# EasyEDA Pro project ProDoc_Board1.epro

# Schematic Schematic1

## Sheets
1 P1: Board Name: Board1; Create Date: 2025-09-09; Page Name: P1; Project Name: usbc-fursuit-fan; Schematic Name: Schematic1; Update Date: 2025-09-09; Company: EasyEDA.com; Page Size: A4; Version: V1.0
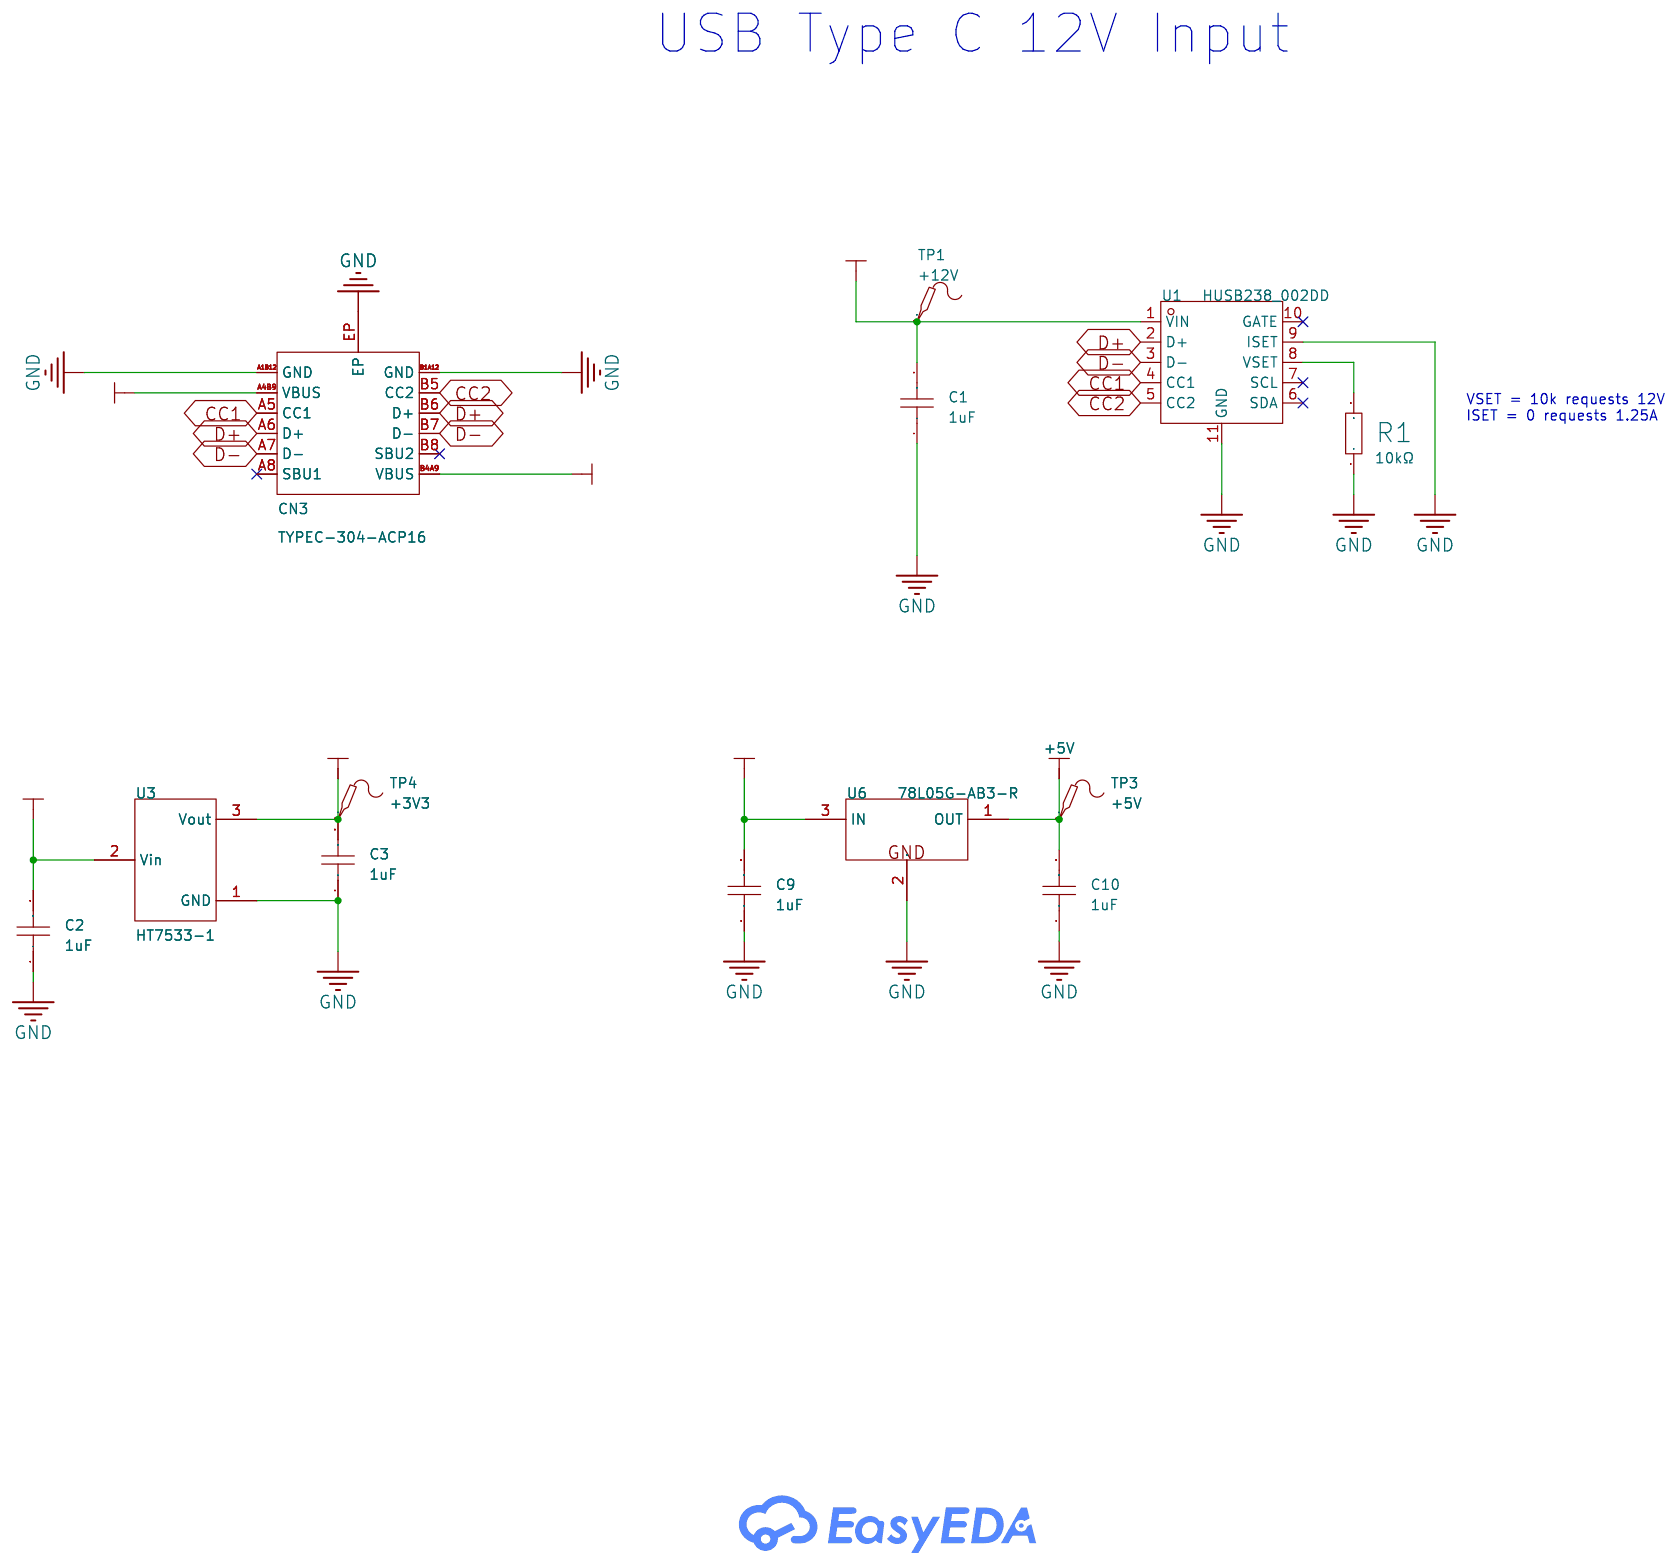
[diagram p0: P1]
2 P2: Page Name: P2; Update Date: 2025-09-11
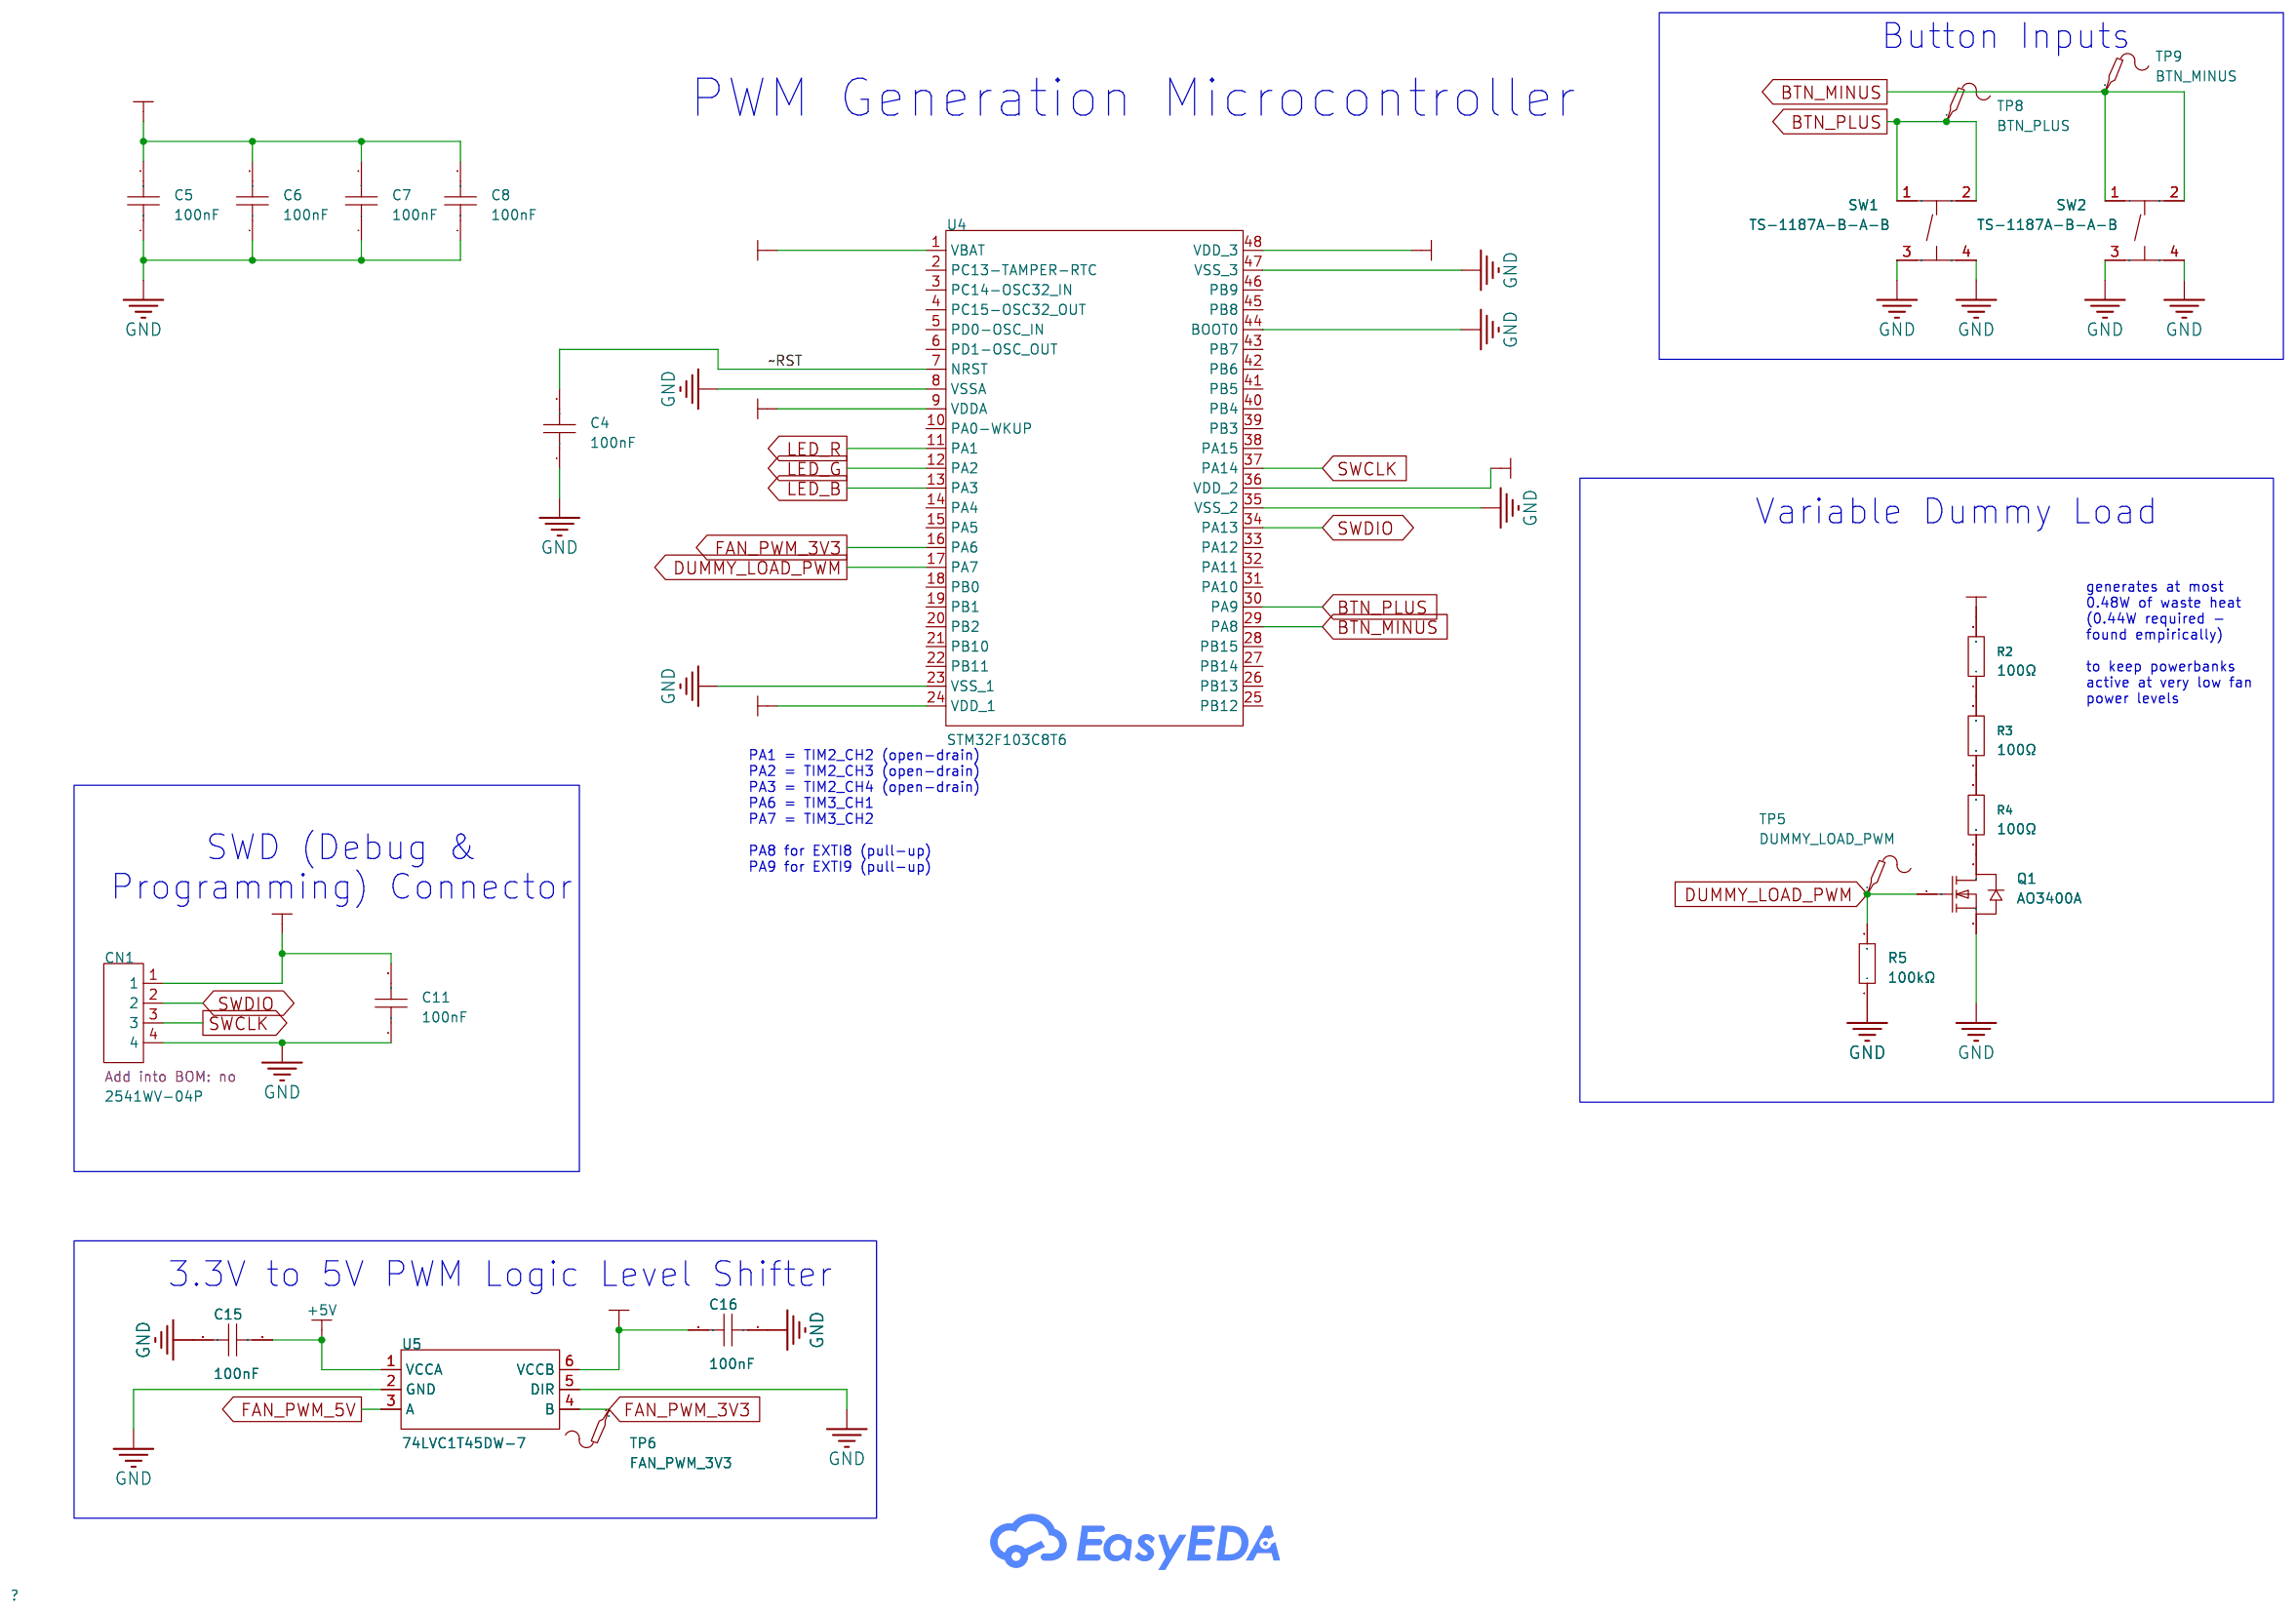
[diagram p1: P2]
3 P3: Page Name: P3; Update Date: 2025-09-11
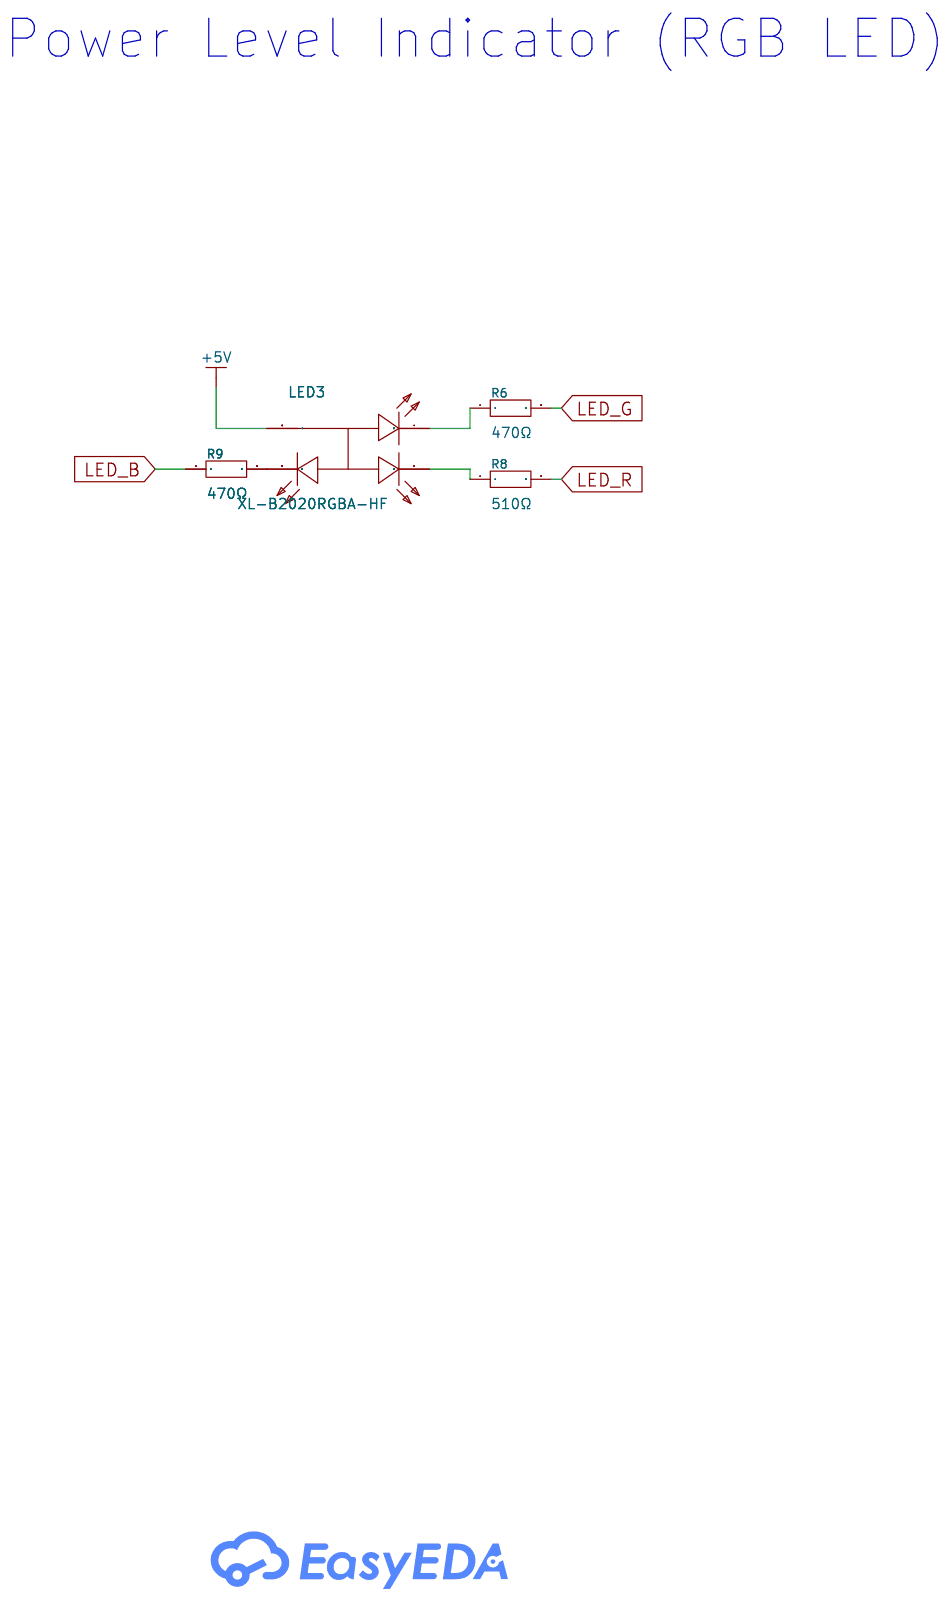
[diagram p2: P3]
4 P4: Create Date: 2025-09-10; Page Name: P4; Update Date: 2025-09-11
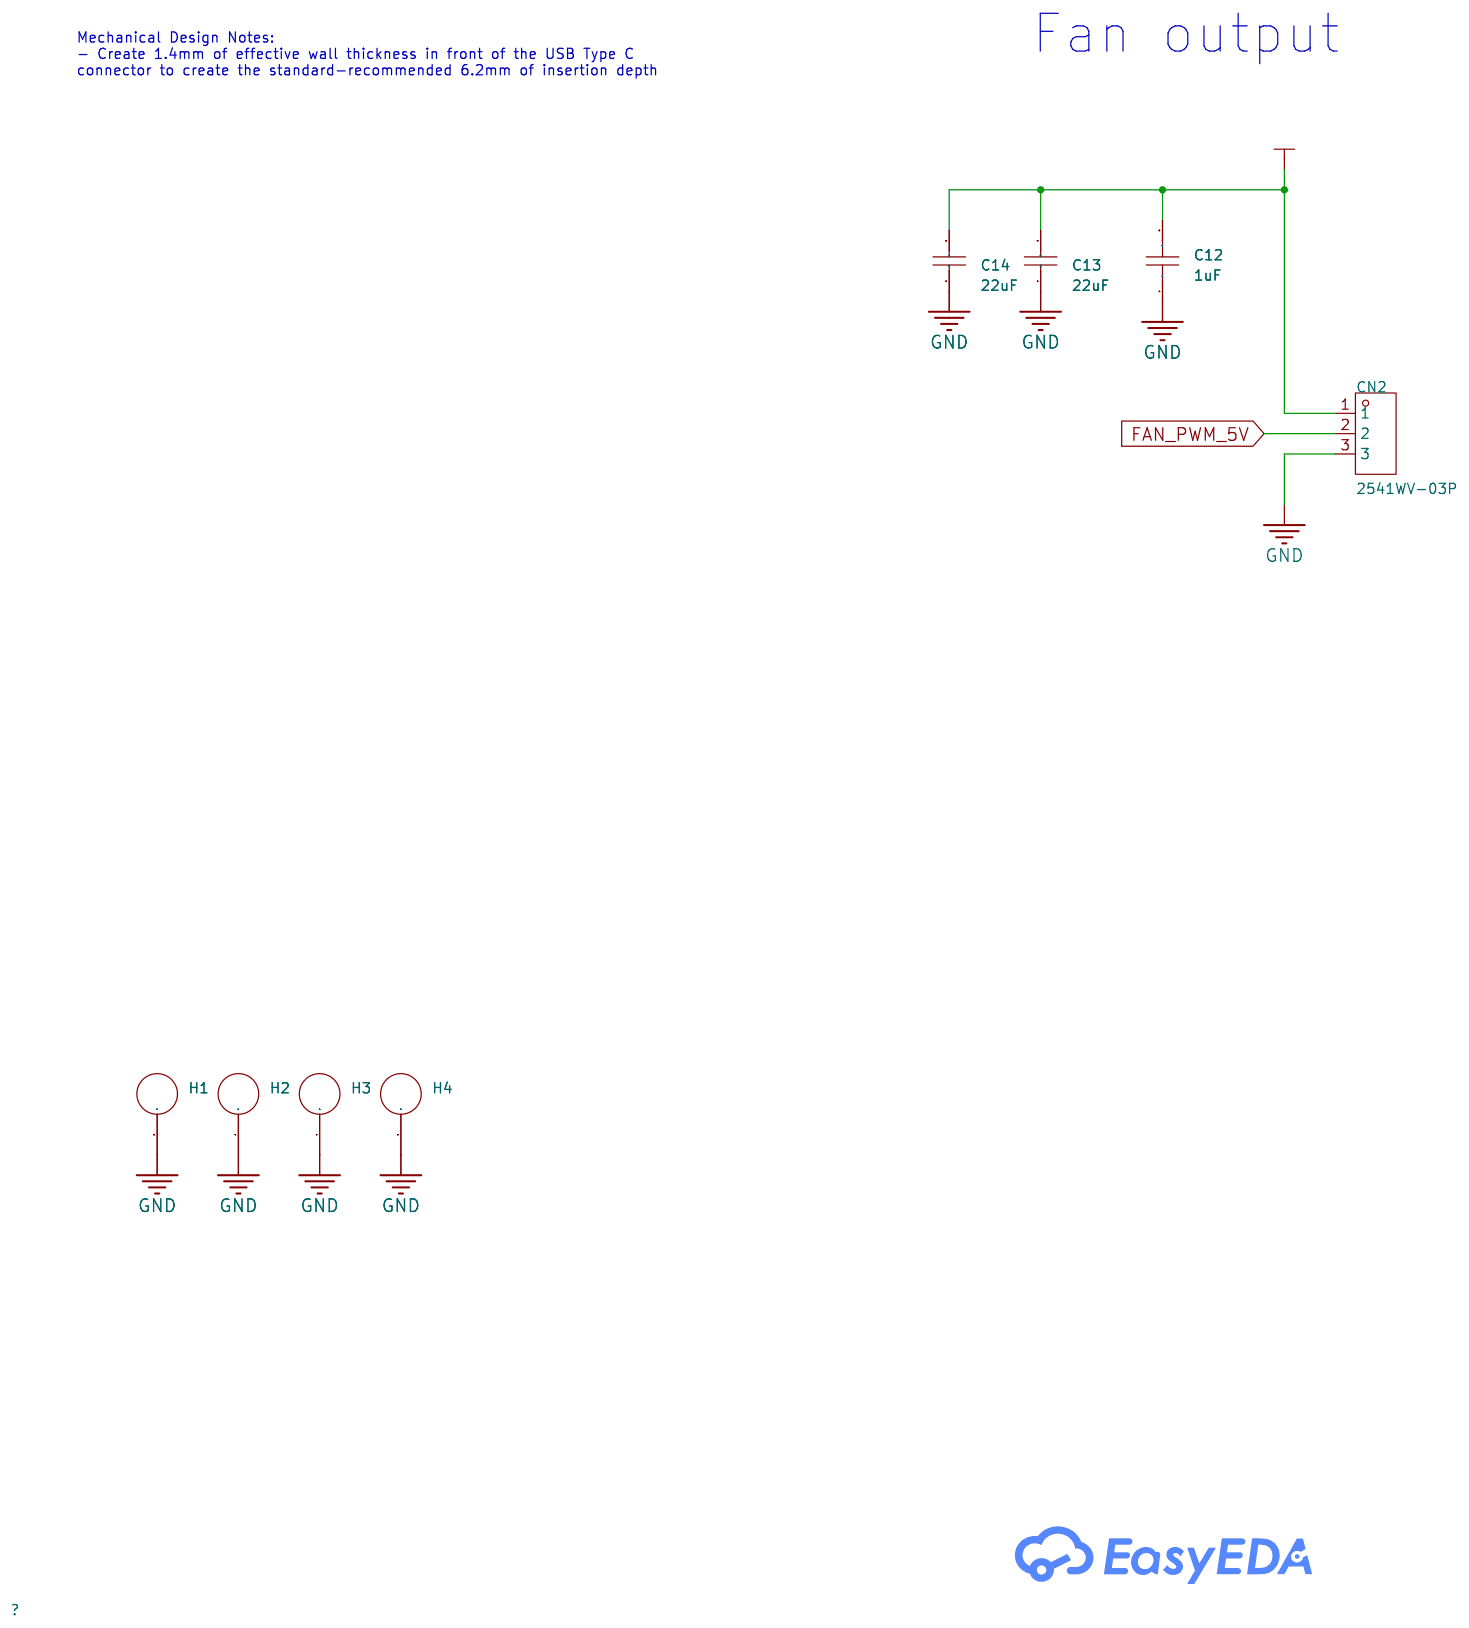
[diagram p3: P4]

## Parts
sheet P1
C1  1uF  [C0603]
C2  1uF  [C0603]
C3  1uF  [C0603]
C9  1uF  [C0603]
C10  1uF  [C0603]
CN3  TYPEC-304-ACP16  [USB-C-SMD_TYPE-C-16P-1]
R1  10kΩ  [R0603]
TP1  +12V  [Test-Point-0.5mm]
TP3  +5V  [Test-Point-0.5mm]
TP4  +3V3  [Test-Point-0.5mm]
U1  HUSB238_002DD  [DFN-10_L3.0-W3.0-P0.50-BL-EP2.5]
U3  HT7533-1  [SOT-89-3_L4.5-W2.5-P1.50-LS4.2-BR]
U6  78L05G-AB3-R  [SOT-89-3_L4.5-W2.5-P1.50-LS4.2-BR]
sheet P2
C4  100nF  [C0603]
C5  100nF  [C0603]
C6  100nF  [C0603]
C7  100nF  [C0603]
C8  100nF  [C0603]
C11  100nF  [C0603]
C15  100nF  [C0603]
C16  100nF  [C0603]
CN1  2541WV-04P  [HDR-TH_4P-P2.54-V-M-1]  (no BOM)
Q1  AO3400A  [SOT-23-3_L2.9-W1.3-P1.90-LS2.4-BR]
R2  100Ω  [R1206]
R3  100Ω  [R1206]
R4  100Ω  [R1206]
R5  100kΩ  [R0603]
SW1  TS-1187A-B-A-B  [SW-SMD_4P-L5.1-W5.1-P3.70-LS6.5-TL_H1.5]
SW2  TS-1187A-B-A-B  [SW-SMD_4P-L5.1-W5.1-P3.70-LS6.5-TL_H1.5]
TP5  DUMMY_LOAD_PWM  [Test-Point-0.5mm]
TP6  FAN_PWM_3V3  [Test-Point-0.5mm]
TP8  BTN_PLUS  [Test-Point-0.5mm]
TP9  BTN_MINUS  [Test-Point-0.5mm]
U4  STM32F103C8T6  [LQFP-48_L7.0-W7.0-P0.50-LS9.0-BL]
U5  74LVC1T45DW-7  [SC-70-6_L2.2-W1.3-P0.65-LS2.1-BR]
sheet P3
LED3  XL-B2020RGBA-HF  [LED-SMD_4P-L2.1-W2.1-P1.0-BL]
R6  470Ω  [R0402]
R8  510Ω  [R0402]
R9  470Ω  [R0402]
sheet P4
C12  1uF  [C0603]
C13  22uF  [C1206]
C14  22uF  [C1206]
CN2  2541WV-03P  [HDR-TH_3P-P2.54-V-M-2]  (no BOM)
H1  -  [HOLE_D2M5_D4M0_PAD_PTH]
H2  -  [HOLE_D2M5_D4M0_PAD_PTH]
H3  -  [HOLE_D2M5_D4M0_PAD_PTH]
H4  -  [HOLE_D2M5_D4M0_PAD_PTH]

## Library data of the parts
C1-C3 C9 C10 C12 = CL10A105KB8NNNC: Capacitance:1uF Tolerance:±10% Tolerance:±10% Voltage Rating:50V Temperature Coefficient:X5R; LCSC Part Name: 1uF ±10% 50V; Supplier Part: C15849; Manufacturer: SAMSUNG(三星); Supplier Footprint: 0603; JLCPCB Part Class: Basic Part; Datasheet: https://item.szlcsc.com/datasheet/CL10A105KB8NNNC/16531.html; Supplier: LCSC; Tolerance: ±10%; Voltage Rating: 50V; Temperature Coefficient: X5R
CN3 = TYPEC-304-ACP16: Connector Type:Type-C Protocol Standard:- Gender:Female Mounting Type:Surface Mount, Right Angle Number of Contacts:16P Number of Ports:1 Current Rating-Power:3A Voltage Rating:20V Connect-Disconnect Life:10,000 Cycles Length:7.35mm Detection color:Black; LCSC Part Name: Type-C 母 卧贴; Supplier Part: C2982555; Manufacturer: XUNPU(讯普); Supplier Footprint: SMD; JLCPCB Part Class: Extended Part; Datasheet: https://item.szlcsc.com/datasheet/TYPEC-304-ACP16/3412817.html; Supplier: LCSC; Connector Type: Type-C; Gender: Female; Mounting Type: Surface Mount, Right Angle; Number of Contacts: 16P; Number of Ports: 1; Current Rating-Power: 3A; Voltage Rating: 20V; Connect-Disconnect Life: 10,000 Cycles; Length: 7.35mm; Detection color: Black; Operating Temperature: -40℃~+85℃
R1 = 0603WAF1002T5E: Type:Thick Film Resistor Resistance:10kΩ Tolerance:±1% Tolerance:±1% Power(Watts):100mW Voltage-Supply(Max):75V Temperature Coefficient:±100ppm/℃ Temperature Coefficient:±100ppm/℃ Operating Temperature:-55℃~+155℃ Operating Temperature:-55℃~+155℃; LCSC Part Name: 厚膜电阻 10kΩ ±1% 100mW; Supplier Part: C25804; Manufacturer: UNI-ROYAL(厚声); Supplier Footprint: 0603; JLCPCB Part Class: Basic Part; Datasheet: https://item.szlcsc.com/datasheet/0603WAF1002T5E/26547.html; Supplier: LCSC; Type: Thick Film Resistor; Tolerance: ±1%; Power(Watts): 100mW; Voltage-Supply(Max): 75V; Temperature Coefficient: ±100ppm/℃; Operating Temperature: -55℃~+155℃
TP1 TP3-TP6 TP8 TP9 = Test-Point: Test Point 测试点
U1 = HUSB238_002DD: Supplier Part: C7471904; Manufacturer: Hynetek(慧能泰); Supplier Footprint: DFN-10L(3x3); JLCPCB Part Class: Extended Part; Datasheet: https://item.szlcsc.com/datasheet/HUSB238_002DD/8528237.html; Supplier: LCSC
U3 = HT7533-1_C14289: Output Type:Fixed Voltage - Supply:30V Output Voltage:3.3V Output Voltage:3.3V Output Current:100mA Power Supply Rejection Ratio (PSRR):- Voltage Dropout:55mV@(1mA) standby current:- Output Configuration:Positive electrode Number of Outputs:1; LCSC Part Name: 输入30V 输出3.3V 100mA; Supplier Part: C14289; Manufacturer: HOLTEK(合泰/盛群); Supplier Footprint: SOT-89-3; JLCPCB Part Class: Basic Part; Datasheet: https://atta.szlcsc.com/upload/public/pdf/source/20250210/C9238B1D00F83046D6644632F130CE9C.pdf; Supplier: LCSC; Output Type: Fixed; Voltage - Supply: 30V; Output Voltage: 3.3V; Output Current: 100mA; Voltage Dropout: 55mV@(1mA); Output Configuration: Positive electrode; Number of Outputs: 1
U6 = 78L05G-AB3-R: Output Type:Fixed Voltage - Supply:30V Output Voltage:5V Output Voltage:5V Output Current:100mA Power Supply Rejection Ratio (PSRR):- Voltage Dropout:1.7V@(40mA) Noise:- Features:Short Circuit Protection；Over Temperature Protection；Over Current Protection; LCSC Part Name: 输入30V 输出5V 100mA; Supplier Part: C71136; Manufacturer: UTC(友顺); Supplier Footprint: SOT-89-3; JLCPCB Part Class: Basic Part; Datasheet: https://item.szlcsc.com/datasheet/78L05G-AB3-R/72235.html; Supplier: LCSC; Output Type: Fixed; Voltage - Supply: 30V; Output Voltage: 5V; Output Current: 100mA; Voltage Dropout: 1.7V@(40mA); Features: Short Circuit Protection；Over Temperature Protection；Over Current Protection; Operating Temperature: -40℃~+85℃; Output Configuration: Positive; Number of Outputs: 1
C4-C8 C11 C15 C16 = CC0603KRX7R9BB104: Capacitance:100nF Tolerance:±10% Tolerance:±10% Voltage Rating:50V Temperature Coefficient:X7R; LCSC Part Name: 100nF ±10% 50V; Supplier Part: C14663; Manufacturer: YAGEO(国巨); Supplier Footprint: 0603; JLCPCB Part Class: Basic Part; Datasheet: https://item.szlcsc.com/datasheet/CC0603KRX7R9BB104/15331.html; Supplier: LCSC; Tolerance: ±10%; Voltage Rating: 50V; Temperature Coefficient: X7R
CN1 = 2541WV-04P: Pin Structure:1x4P Pitch:2.54mm Circluar Pins/Square Pins:Pin Header Mounting Type:Through Hole Number of Rows:1 Number of Pins:4P Length of Mating Pin:6mm Insulation Height:2.54mm Length of End Connection Pin:3mm Contact Plating:Gold Operating Temperatur; LCSC Part Name: 1x4P 间距:2.54mm 方针 直插; Supplier Part: C5383113; Manufacturer: HanElectricity(瀚源); Supplier Footprint: 插件,P=2.54mm; JLCPCB Part Class: Extended Part; Datasheet: https://item.szlcsc.com/datasheet/2541WV-04P/6258473.html; Supplier: LCSC; Pin Structure: 1x4P; Pitch: 2.54mm; Circluar Pins/Square Pins: Pin Header; Mounting Type: Through Hole; Number of Rows: 1; Number of Pins: 4P; Length of Mating Pin: 6mm; Insulation Height: 2.54mm; Length of End Connection Pin: 3mm; Contact Plating: Gold; Operating Temperature: -55℃~+105℃
Q1 = AO3400A_C20917: Number:- Drain to Source Voltage:30V Current - Continuous Drain(Id):- RDS(on):48mΩ@2.5V Pd - Power Dissipation:- Gate Threshold Voltage (Vgs(th)):1.45V@250uA Gate Charge(Qg):7nC@10V Input Capacitance(Ciss):630pF@15V Reverse Transfer Capacitance (Crss@Vds); LCSC Part Name: 1个N沟道 耐压:30V 电流:5.7A; Supplier Part: C20917; Manufacturer: AOS; Supplier Footprint: SOT-23-3L; JLCPCB Part Class: Basic Part; Datasheet: https://item.szlcsc.com/datasheet/AO3400A/21629.html; Supplier: LCSC; Drain to Source Voltage: 30V; RDS(on): 48mΩ@2.5V; Gate Threshold Voltage (Vgs(th)): 1.45V@250uA; Gate Charge(Qg): 7nC@10V; Input Capacitance(Ciss): 630pF@15V; Operating Temperature: -55℃~+150℃@(Tj); Type: N-Channel
R2-R4 = 1206W4F1000T5E_C17901: Type:Thick Film Resistor Resistance:100Ω Tolerance:±1% Tolerance:±1% Power(Watts):250mW Voltage-Supply(Max):200V Temperature Coefficient:±100ppm/℃ Temperature Coefficient:±100ppm/℃ Operating Temperature:-55℃~+155℃ Operating Temperature:-55℃~+155℃; LCSC Part Name: 100Ω ±1% 250mW 厚膜电阻; Supplier Part: C17901; Manufacturer: UNI-ROYAL(厚声); Manufacturer Part: 1206W4F1000T5E; Supplier Footprint: 1206; JLCPCB Part Class: Basic Part; Datasheet: https://item.szlcsc.com/datasheet/1206W4F1000T5E/18589.html; Supplier: LCSC; Type: Thick Film Resistor; Tolerance: ±1%; Power(Watts): 250mW; Voltage-Supply(Max): 200V; Temperature Coefficient: ±100ppm/℃; Operating Temperature: -55℃~+155℃
R5 = 0603WAF1003T5E: Type:Thick Film Resistor Resistance:100kΩ Tolerance:±1% Tolerance:±1% Power(Watts):100mW Voltage-Supply(Max):75V Temperature Coefficient:±100ppm/℃ Temperature Coefficient:±100ppm/℃ Operating Temperature:-55℃~+155℃ Operating Temperature:-55℃~+155℃; LCSC Part Name: 100kΩ ±1% 100mW 厚膜电阻; Supplier Part: C25803; Manufacturer: UNI-ROYAL(厚声); Supplier Footprint: 0603; JLCPCB Part Class: Basic Part; Datasheet: https://item.szlcsc.com/datasheet/0603WAF1003T5E/26546.html; Supplier: LCSC; Type: Thick Film Resistor; Tolerance: ±1%; Power(Watts): 100mW; Voltage-Supply(Max): 75V; Temperature Coefficient: ±100ppm/℃; Operating Temperature: -55℃~+155℃
SW1 SW2 = TS-1187A-B-A-B: Circuit:SPST Actuator Style:Round Button Operating Force:1.6N Mounting Type:Surface Mount,Vertical Length:5.1mm Width:5.1mm Switch Height:1.5mm with Bracket:Without Bracket Contact Current:50mA Voltage Rating:12V Actuator/Cap Color:Gold With Lamp:No Life:; LCSC Part Name: 5.1*5.1*1.5mm 立贴 轻触开关; Supplier Part: C318884; Manufacturer: XKB Connection(中国星坤); Supplier Footprint: SMD; JLCPCB Part Class: Basic Part; Datasheet: https://item.szlcsc.com/datasheet/TS-1187A-B-A-B/299976.html; Supplier: LCSC; Circuit: SPST; Actuator Style: Round Button; Operating Force: 1.6N; Mounting Type: Surface Mount,Vertical; Length: 5.1mm; Width: 5.1mm; Switch Height: 1.5mm; with Bracket: Without Bracket; Contact Current: 50mA; Voltage Rating: 12V; Actuator/Cap Color: Gold; With Lamp: No; Life: 100,000 Cycles; Operating Temperature: -30℃~+85℃
U4 = STM32F103C8T6: CPU Core:ARM-M3 CPU Maximum Speed:72MHz Program Storage Size:64KB Program Memory Type:FLASH Number of I/O:37 ADC (Bit):12bit Voltage - Supply:2V~3.6V Voltage - Supply:2V~3.6V Applications:-; LCSC Part Name: 主流增强型ARM Cortex-M3 MCU，具有64 KB Flash、72 MHz CPU、电机控制、USB和CAN; Supplier Part: C8734; Manufacturer: ST(意法半导体); Supplier Footprint: LQFP-48(7x7); JLCPCB Part Class: Extended Part; Datasheet: https://item.szlcsc.com/datasheet/STM32F103C8T6/9243.html; Supplier: LCSC; CPU Core: ARM-M3; CPU Maximum Speed: 72MHz; Program Storage Size: 64KB; Program Memory Type: FLASH; Number of I/O: 37; ADC (Bit): 12bit; Voltage - Supply: 2V~3.6V
U5 = 74LVC1T45DW-7: Channel Type:Bidirectional Voltage - Supply(VCCA):1.65V~5.5V Voltage - Supply(VCCA):1.65V~5.5V Voltage - Supply(VCCB):1.65V~5.5V Voltage - Supply(VCCB):1.65V~5.5V Number of Circuits:1 Number of Circuits:1 Output Type:Tri-State Operating Temperature:-40℃~+; Supplier Part: C168855; Manufacturer: DIODES(美台); Supplier Footprint: SC-70-6(SOT-363); JLCPCB Part Class: Extended Part; Datasheet: https://item.szlcsc.com/datasheet/74LVC1T45DW-7/180239.html; Supplier: LCSC; Channel Type: Bidirectional; Voltage - Supply(VCCA): 1.65V~5.5V; Voltage - Supply(VCCB): 1.65V~5.5V; Number of Circuits: 1; Output Type: Tri-State; Operating Temperature: -40℃~+125℃
LED3 = XL-B2020RGBA-HF: LCSC Part Name: 发光二极管 高亮度七彩 封装：2020黑色哑光 功率 50mW；70mW；70mW 正向电流 20mA 主波长 620nm~630nm；520~530nm；460~470nm 峰值波长 625nm; 520nm; 465nm 工作温度 -20℃~+85℃; Supplier Part: C22461782; Manufacturer: XINGLIGHT(成兴光); Supplier Footprint: SMD-4P,2.1x2.1mm; JLCPCB Part Class: Extended Part; Datasheet: https://atta.szlcsc.com/upload/public/pdf/source/20240613/35F2B2E569AC177F1ACCCDF654FDB2DF.pdf; Supplier: LCSC
R6 R9 = 0402WGF4700TCE: Type:Thick Film Resistor Resistance:470Ω Tolerance:±1% Tolerance:±1% Power(Watts):62.5mW Voltage-Supply(Max):50V Temperature Coefficient:±100ppm/℃ Temperature Coefficient:±100ppm/℃ Operating Temperature:-55℃~+155℃ Operating Temperature:-55℃~+155℃; LCSC Part Name: 470Ω ±1% 62.5mW 厚膜电阻; Supplier Part: C25117; Manufacturer: UNI-ROYAL(厚声); Supplier Footprint: 0402; JLCPCB Part Class: Basic Part; Datasheet: https://item.szlcsc.com/datasheet/0402WGF4700TCE/25860.html; Supplier: LCSC; Type: Thick Film Resistor; Tolerance: ±1%; Power(Watts): 62.5mW; Voltage-Supply(Max): 50V; Temperature Coefficient: ±100ppm/℃; Operating Temperature: -55℃~+155℃
R8 = 0402WGF5100TCE: Type:Thick Film Resistor Resistance:510Ω Tolerance:±1% Tolerance:±1% Power(Watts):62.5mW Voltage-Supply(Max):50V Temperature Coefficient:±100ppm/℃ Temperature Coefficient:±100ppm/℃ Operating Temperature:-55℃~+155℃ Operating Temperature:-55℃~+155℃; LCSC Part Name: 510Ω ±1% 62.5mW 厚膜电阻; Supplier Part: C25123; Manufacturer: UNI-ROYAL(厚声); Supplier Footprint: 0402; JLCPCB Part Class: Basic Part; Datasheet: https://item.szlcsc.com/datasheet/0402WGF5100TCE/25866.html; Supplier: LCSC; Type: Thick Film Resistor; Tolerance: ±1%; Power(Watts): 62.5mW; Voltage-Supply(Max): 50V; Temperature Coefficient: ±100ppm/℃; Operating Temperature: -55℃~+155℃
C13 C14 = CL31A226KAHNNNE: Capacitance:22uF Tolerance:±10% Tolerance:±10% Voltage Rating:25V Temperature Coefficient:X5R; LCSC Part Name: 22uF ±10% 25V; Supplier Part: C12891; Manufacturer: SAMSUNG(三星); Supplier Footprint: 1206; JLCPCB Part Class: Basic Part; Datasheet: https://item.szlcsc.com/datasheet/CL31A226KAHNNNE/13537.html; Supplier: LCSC; Tolerance: ±10%; Voltage Rating: 25V; Temperature Coefficient: X5R
CN2 = 2541WV-03P: Pin Structure:1x3P Pitch:2.54mm Circluar Pins/Square Pins:Pin Header Mounting Type:Through Hole Number of Rows:1 Number of Pins:3P Length of Mating Pin:6mm Insulation Height:2.54mm Length of End Connection Pin:3mm Contact Plating:Gold Operating Temperatur; LCSC Part Name: 1x3P 间距:2.54mm 方针 直插; Supplier Part: C5383112; Manufacturer: HanElectricity(瀚源); Supplier Footprint: 插件,P=2.54mm; JLCPCB Part Class: Extended Part; Datasheet: https://item.szlcsc.com/datasheet/2541WV-03P/6258472.html; Supplier: LCSC; Pin Structure: 1x3P; Pitch: 2.54mm; Circluar Pins/Square Pins: Pin Header; Mounting Type: Through Hole; Number of Rows: 1; Number of Pins: 3P; Length of Mating Pin: 6mm; Insulation Height: 2.54mm; Length of End Connection Pin: 3mm; Contact Plating: Gold; Operating Temperature: -55℃~+105℃
H1-H4 = HOLE_D2M5_D4M0_PAD_PTH: 2.5mm diameter plated M3 clearance hole with 4.0mm diameter pad around it to clear nuts and washers. The symbol has a pin to connect this pad to a net if required. Place a Not Connected 'X' on the pin if the hole is to be isolated.

## Nets
+3V3: C3.2 C5.2 C6.2 C7.2 C8.2 C11.2 C16.2 CN1.1 TP4.1 U3.3(Vout) U4.1(VBAT) U4.9(VDDA) U4.24(VDD_1) U4.36(VDD_2) U4.48(VDD_3) U5.6(VCCB)
+5V: C10.2 C15.1 LED3.3(A) TP3.1 U5.1(VCCA) U6.1(OUT)
+12V: C1.2 C2.2 C9.2 C12.2 C13.2 C14.2 CN2.1 CN3.A4B9(VBUS) CN3.B4A9(VBUS) R2.2 TP1.1 U1.1(VIN) U3.2(Vin) U6.3(IN)
GND: C1.1 C2.1 C3.1 C4.1 C5.1 C6.1 C7.1 C8.1 C9.1 C10.1 C11.1 C12.1 C13.1 C14.1 C15.2 C16.1 CN1.4 CN2.3 CN3.A1B12(GND) CN3.B1A12(GND) CN3.EP H1.1 H2.1 H3.1 H4.1 Q1.2(S) R1.1 R5.1 SW1.3(C) SW1.4(D) SW2.3(C) SW2.4(D) U1.9(ISET) U1.11(GND) U3.1(GND) U4.8(VSSA) U4.23(VSS_1) U4.35(VSS_2) U4.44(BOOT0) U4.47(VSS_3) U5.2(GND) U5.5(DIR) U6.2(GND)
BTN_MINUS: SW2.1(A) SW2.2(B) TP9.1 U4.29(PA8)
BTN_PLUS: SW1.1(A) SW1.2(B) TP8.1 U4.30(PA9)
CC1: CN3.A5(CC1) U1.4(CC1)
CC2: CN3.B5(CC2) U1.5(CC2)
D+: CN3.A6(D+) CN3.B6(D+) U1.2(D+)
D-: CN3.A7(D-) CN3.B7(D-) U1.3(D-)
DUMMY_LOAD_PWM: Q1.1(G) R5.2 TP5.1 U4.17(PA7)
FAN_PWM_3V3: TP6.1 U4.16(PA6) U5.4(B)
FAN_PWM_5V: CN2.2 U5.3(A)
LED_B: R9.1 U4.13(PA3)
LED_G: R6.2 U4.12(PA2)
LED_R: R8.2 U4.11(PA1)
SWCLK: CN1.3 U4.37(PA14)
SWDIO: CN1.2 U4.34(PA13)
~RST: C4.2 U4.7(NRST)
$1N1426: R1.2 U1.8(VSET)
$2N1442: R2.1 R3.2
$2N1481: R3.1 R4.2
$2N2065: Q1.3(D) R4.1
$3N2042: LED3.1(C) R8.1
$3N2244: LED3.2(C) R9.2
$3N2246: LED3.4(C) R6.1

Not connected (* = marked no-connect by the designer): CN3 A8(SBU1)* B8(SBU2)*; U1 6(SDA)* 7(SCL)* 10(GATE)*; U4 2(PC13-TAMPER-RTC) 3(PC14-OSC32_IN) 4(PC15-OSC32_OUT) 5(PD0-OSC_IN) 6(PD1-OSC_OUT) 10(PA0-WKUP) 14(PA4) 15(PA5) 18(PB0) 19(PB1) 20(PB2) 21(PB10) 22(PB11) 25(PB12) 26(PB13) 27(PB14) 28(PB15) 31(PA10) 32(PA11) 33(PA12) 38(PA15) 39(PB3) 40(PB4) 41(PB5) 42(PB6) 43(PB7) 45(PB8) 46(PB9)

## Notes on the sheets
sheet 1
- USB Type C 12V Input
- VSET = 10k requests 12V
  ISET = 0 requests 1.25A
sheet 2
- Button Inputs
- PWM Generation Microcontroller
- Variable Dummy Load
- generates at most
  0.48W of waste heat
  (0.44W required -
  found empirically)
  to keep powerbanks
  active at very low fan
  power levels
- SWD (Debug &
  Programming) Connector
- PA1 = TIM2_CH2 (open-drain)
  PA2 = TIM2_CH3 (open-drain)
  PA3 = TIM2_CH4 (open-drain)
  PA6 = TIM3_CH1
  PA7 = TIM3_CH2
  PA8 for EXTI8 (pull-up)
  PA9 for EXTI9 (pull-up)
- 3.3V to 5V PWM Logic Level Shifter
sheet 3
- Power Level Indicator (RGB LED)
sheet 4
- Fan output
- Mechanical Design Notes:
  - Create 1.4mm of effective wall thickness in front of the USB Type C
  connector to create the standard-recommended 6.2mm of insertion depth

# Board PCB1
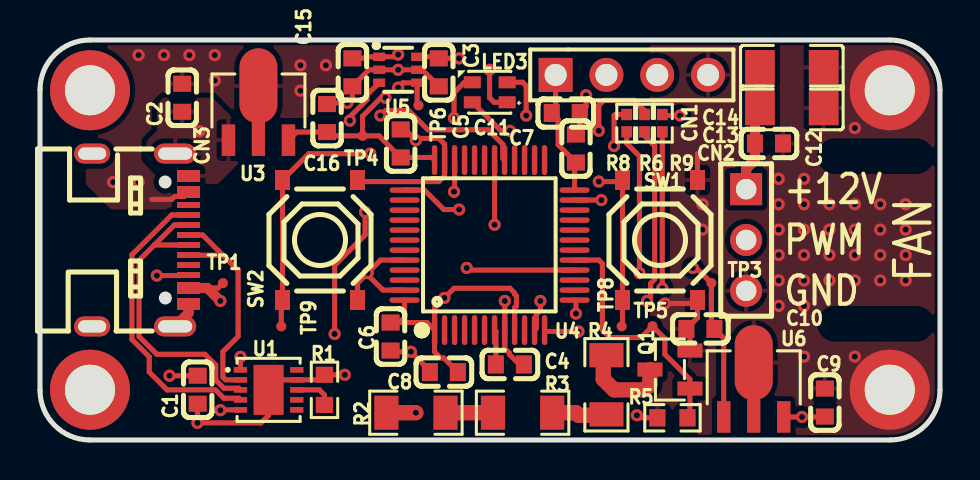
[diagram p4: board, top side]
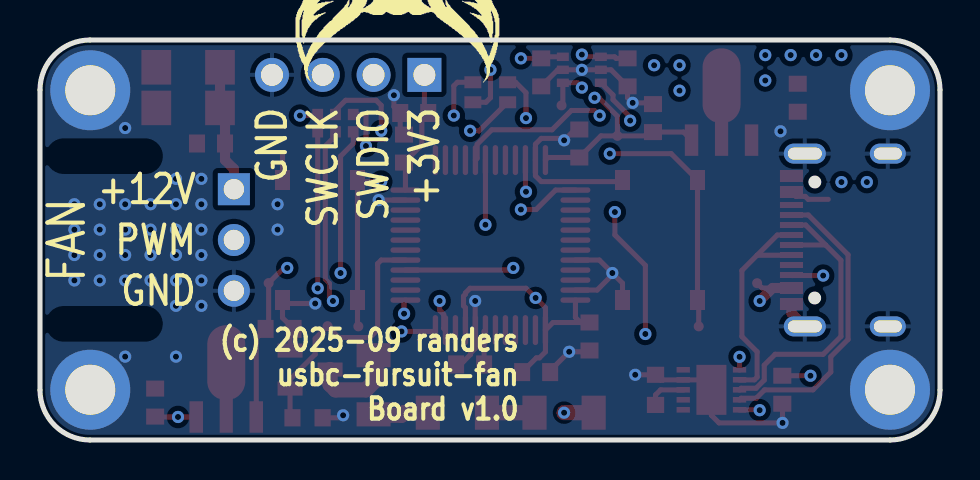
[diagram p5: board, bottom side, seen from below]

Outline 45 x 20 mm; copper layers: Top Layer, Inner1, Inner2, Bottom Layer. Coordinates in mm from the lower left corner of the outline.
Outline path: 0,17.5 0,2.5 arc(0.73,0.73) 2.5,0 42.5,0 arc(44.27,0.73) 45,2.5 45,17.5 arc(44.27,19.27) 42.5,20 2.5,20 arc(0.73,19.27) 0,17.5
Stack: Top Layer 0.035mm Outer layer thickness 1oz / Dielectric1 0.2104mm 7628 RC49% 8.6mil / Inner1 0.0152mm Inner layer thickness / Dielectric2 1.065mm 1.1mm H/HOZ Copper / Inner2 0.0152mm Inner layer thickness / Dielectric3 0.2104mm 7628 RC49% 8.6mil / Bottom Layer 0.035mm Outer layer thickness 1oz

## Design rules (mm)
template: JLCPCB Capability(Two Layers Board)
spacing copperThickness1oz (default): track to track 0.102, other pairs 0.152 to 0.3
spacing copperThickness2oz: track to track 0.203, other pairs 0.152 to 0.3
track width copperThickness1oz (default): min 0.127, default 0.254, max 2.54
track width copperThickness2oz: min 0.203, default 0.254, max 2.54
differential pair differentialPair (default): width min 0.127, default 0.254, max 2.54; gap min 0.152, default 0.152
via viaSize (default): diameter min 0.5, default 0.61, max 10; hole min 0.3, default 0.305, max 6.3

## Placement (name value [footprint] x y rotation side)
C1  1uF  [C0603]  7.88 2.51 90 top
C2  1uF  [C0603]  7.11 17.11 90 top
C3  1uF  [C0603]  19.94 18.38 90 top
C4  100nF  [C0603]  23.5 3.78 180 top
C5  100nF  [C0603]  18.03 14.83 270 top
C6  100nF  [C0603]  17.53 5.17 90 top
C7  100nF  [C0603]  26.8 14.57 270 top
C8  100nF  [C0603]  20.19 3.4 0 top
C9  1uF  [C0603]  39.24 1.87 270 top
C10  1uF  [C0603]  33.02 5.56 0 top
C11  100nF  [C0603]  26.29 16.35 180 top
C12  1uF  [C0603]  36.45 14.83 180 top
C13  22uF  [C1206]  37.59 16.6 180 top
C14  22uF  [C1206]  37.59 18.64 180 top
C15  100nF  [C0603]  15.62 18.38 270 top
C16  100nF  [C0603]  14.35 16.1 270 top
CN1  2541WV-04P  [HDR-TH_4P-P2.54-V-M-1]  29.59 18.25 0 top
CN2  2541WV-03P  [HDR-TH_3P-P2.54-V-M-2]  35.31 10 90 top
CN3  TYPEC-304-ACP16  [USB-C-SMD_TYPE-C-16P-1]  5.02 10 270 top
H1  -  [HOLE_D2M5_D4M0_PAD_PTH]  2.5 17.49 0 top
H2  -  [HOLE_D2M5_D4M0_PAD_PTH]  42.49 2.51 0 top
H3  -  [HOLE_D2M5_D4M0_PAD_PTH]  2.5 2.51 0 top
H4  -  [HOLE_D2M5_D4M0_PAD_PTH]  42.49 17.49 0 top
LED3  XL-B2020RGBA-HF  [LED-SMD_4P-L2.1-W2.1-P1.0-BL]  22.49 17.39 180 top
Q1  AO3400A  [SOT-23-3_L2.9-W1.3-P1.90-LS2.4-BR]  31.5 3.52 0 top
R1  10kΩ  [R0603]  14.22 2.51 270 top
R2  100Ω  [R1206]  18.8 1.36 180 top
R3  100Ω  [R1206]  24.13 1.36 180 top
R4  100Ω  [R1206]  28.32 2.76 270 top
R5  100kΩ  [R0603]  31.62 1.11 0 top
R6  470Ω  [R0402]  30.23 15.84 270 top
R8  510Ω  [R0402]  29.34 15.84 270 top
R9  470Ω  [R0402]  31.12 15.84 90 top
SW1  TS-1187A-B-A-B  [SW-SMD_4P-L5.1-W5.1-P3.70-LS6.5-TL_H1.5]  31 10 90 top
SW2  TS-1187A-B-A-B  [SW-SMD_4P-L5.1-W5.1-P3.70-LS6.5-TL_H1.5]  14 10 90 top
TP1  +12V  [Test-Point-0.5mm]  9.14 7.84 0 top
TP3  +5V  [Test-Point-0.5mm]  33.57 7.85 0 top
TP4  +3V3  [Test-Point-0.5mm]  16.13 15.21 0 top
TP5  DUMMY_LOAD_PWM  [Test-Point-0.5mm]  30.62 5.69 0 top
TP6  FAN_PWM_3V3  [Test-Point-0.5mm]  18.92 16.73 0 top
TP8  BTN_PLUS  [Test-Point-0.5mm]  29.08 5.68 0 top
TP9  BTN_MINUS  [Test-Point-0.5mm]  12.06 5.68 0 top
U1  HUSB238_002DD  [DFN-10_L3.0-W3.0-P0.50-BL-EP2.5]  11.43 2.51 270 top
U3  HT7533-1  [SOT-89-3_L4.5-W2.5-P1.50-LS4.2-BR]  10.92 16.35 270 top
U4  STM32F103C8T6  [LQFP-48_L7.0-W7.0-P0.50-LS9.0-BL]  22.48 9.75 0 top
U5  74LVC1T45DW-7  [SC-70-6_L2.2-W1.3-P0.65-LS2.1-BR]  17.91 18.51 180 top
U6  78L05G-AB3-R  [SOT-89-3_L4.5-W2.5-P1.50-LS4.2-BR]  35.69 2.51 270 top

## Footprints (pads in the part's own frame, mm; a bottom-side part is the same pattern mirrored in y, then rotated)
C0603
  rect 0.8x0.9 smd: 1(-0.7,0) 2(0.7,0)
C1206
  rect 1.485x1.728 smd: 1(-1.593,0) 2(1.593,0)
DFN-10_L3.0-W3.0-P0.50-BL-EP2.5
  rect 0.28x0.665 smd: 1(-1,-1.407) 2(-0.5,-1.407) 3(0,-1.407) 4(0.5,-1.407) 5(1,-1.407) 6(1,1.407) 7(0.5,1.407) 8(0,1.407) 9(-0.5,1.407) 10(-1,1.407)
  rect 2.5x1.5 smd: 11(0,0)
HDR-TH_3P-P2.54-V-M-2
  rect 1.6x1.6 hole 1.02: 1(2.54,0)
  round 1.6 hole 1.02: 2(0,0) 3(-2.54,0)
HDR-TH_4P-P2.54-V-M-1
  rect 1.7x1.7 hole 1.1: 1(-3.81,0)
  round 1.7 hole 1.1: 2(-1.27,0) 3(1.27,0) 4(3.81,0)
HOLE_D2M5_D4M0_PAD_PTH
  round 4 hole 2.5: 1(0,0)
LED-SMD_4P-L2.1-W2.1-P1.0-BL
  rect 0.85x0.6 smd: 1(0.87,-0.5) 2(-0.87,-0.5) 3(-0.87,0.5) 4(0.87,0.5)
LQFP-48_L7.0-W7.0-P0.50-LS9.0-BL
  oval 0.27x1.5 smd: 1(-2.75,-4.25) 2(-2.25,-4.25) 3(-1.75,-4.25) 4(-1.25,-4.25) 5(-0.75,-4.25) 6(-0.25,-4.25) 7(0.25,-4.25) 8(0.75,-4.25) 9(1.25,-4.25) 10(1.75,-4.25) 11(2.25,-4.25) 12(2.75,-4.25) 25(2.75,4.25) 26(2.25,4.25) 27(1.75,4.25) 28(1.25,4.25) 29(0.75,4.25) 30(0.25,4.25) 31(-0.25,4.25) 32(-0.75,4.25) 33(-1.25,4.25) 34(-1.75,4.25) 35(-2.25,4.25) 36(-2.75,4.25)
  oval 1.5x0.27 smd: 13(4.25,-2.75) 14(4.25,-2.25) 15(4.25,-1.75) 16(4.25,-1.25) 17(4.25,-0.75) 18(4.25,-0.25) 19(4.25,0.25) 20(4.25,0.75) 21(4.25,1.25) 22(4.25,1.75) 23(4.25,2.25) 24(4.25,2.75) 37(-4.25,2.75) 38(-4.25,2.25) 39(-4.25,1.75) 40(-4.25,1.25) 41(-4.25,0.75) 42(-4.25,0.25) 43(-4.25,-0.25) 44(-4.25,-0.75) 45(-4.25,-1.25) 46(-4.25,-1.75) 47(-4.25,-2.25) 48(-4.25,-2.75)
R0402
  rect 0.566x0.54 smd: 1(-0.433,0) 2(0.433,0)
R0603
  rect 0.806x0.864 smd: 1(-0.753,0) 2(0.753,0)
R1206
  rect 1.208x1.701 smd: 1(-1.479,0) 2(1.479,0)
SC-70-6_L2.2-W1.3-P0.65-LS2.1-BR
  rect 0.6x0.42 smd: 1(0.95,-0.65) 2(0.95,0) 3(0.95,0.65) 4(-0.95,0.65) 5(-0.95,0) 6(-0.95,-0.65)
SOT-23-3_L2.9-W1.3-P1.90-LS2.4-BR
  rect 1.25x0.7 smd: 1(1,-0.95) 2(1,0.95) 3(-1,0)
SOT-89-3_L4.5-W2.5-P1.50-LS4.2-BR
  rect 1.575x0.672 smd: 1(1.356,-1.5) 3(1.356,1.5)
  custom 5.377x1.9 smd: 2(-1.356,0)
SW-SMD_4P-L5.1-W5.1-P3.70-LS6.5-TL_H1.5
  rect 1x0.75 smd: 1(-3,1.875) 2(3,1.875) 3(-3,-1.875) 4(3,-1.875)
Test-Point-0.5mm
  round 0.5 smd: 1(0,0)
USB-C-SMD_TYPE-C-16P-1
  rect 0.6x1.15 smd: A1B12(-3.2,2.41) A4B9(-2.4,2.41) B1A12(3.2,2.41) B4A9(2.4,2.41)
  rect 0.3x1.15 smd: A5(-1.25,2.41) A6(-0.25,2.41) A7(0.25,2.41) A8(1.25,2.41) B5(1.75,2.41) B6(0.75,2.41) B7(-0.75,2.41) B8(-1.75,2.41)
  oval 1x2.1 hole 0.6x1.7: EP(-4.32,1.74) EP(4.32,1.74)
  oval 1x1.8 hole 0.6x1.4: EP(-4.32,-2.41) EP(4.32,-2.41)

## Nets
As in the schematic.

Pads without a net: CN3 A8 B8; U1 6 7 10; U4 2 3 4 5 6 10 14 15 18 19 20 21 22 25 26 27 28 31 32 33 38 39 40 41 42 43 45 46

## Via types
v1: diameter 0.61, hole 0.305, Top Layer to Bottom Layer, 92 vias

## Routing (per net, layer and track width the routed paths; a pad name or vN(x,y) marks a point on that pad's centre or on a via; arc(x,y) is an arc through that point)
+3V3: length 55.1
  Top Layer w0.254: U4.9 23.73,6.61 23.82,6.71 23.82,7.19 23.73,7.29 23.73,7.35 23.5,7.59 20.7,7.59 v1(20.22,7.11) 19.73,6.61 U4.1 ; U4.36 19.6,14.13 C5.2 16.95,15.21 TP4.1 ; CN1.1 25.78,16.54 C11.2 25.91,16.03 25.91,14.76 C7.2 26.73,13.8 U4.24 ; U4.48 18.23,6.13 17.97,5.87 ; U4.1 19.73,4.4 20.03,4.11 20.18,4.11 C8.2 ; U4.1 19.35,5.87 17.97,5.87 ; 17.97,5.87 C6.2 ; TP4.1 16.13,16.19 17.05,17.11 v1(17.27,17.11) ; TP4.1 14.54,15.21 C16.2 12.82,15.4 U3.3 ; v1(20.96,19.08) C3.2 19.86,19.16 U5.6
  Inner2 w0.254: v1(20.22,7.11) 17.27,10.05 17.27,14.58 17.37,14.68 17.37,15.75 17.6,15.98 17.6,16.47 17.27,16.8 v1(17.27,17.11) 17.4,16.98 19.94,16.98 20.96,18 v1(20.96,19.08) 21.4,19.53 24.51,19.53 CN1.1
+5V: length 60
  Top Layer w0.254: v1(17.91,19.27) 17.79,19.16 16.27,19.16 16.19,19.08 C15.1 ; U6.1 34.19,5.09 C10.2 33.57,5.71 TP3.1 32.81,8.6 v1(32.64,8.6) ; LED3.3 22.7,16.89 22.48,17.11 v1(22.48,18.51)
  Inner2 w0.254: v1(22.48,18.51) 22.29,18.51 20.41,16.63 19.56,16.63 19.38,16.45 19.38,12.08 22.86,8.6 ; v1(17.91,19.27) 15.65,19.27 14.35,17.97 14.35,11.52 17.4,8.48 17.4,7.33 18.92,5.81 20.57,5.81 22.1,7.33 22.1,7.84 22.86,8.6 ; 22.86,8.6 23.5,9.24 32,9.24 v1(32.64,8.6)
+12V: length 16.7
  Top Layer w0.254: 5.59,12.03 6.59,12.03 6.74,12.18 7.21,12.18 CN3.A4B9 ; C9.2 39.22,1.15 v1(38.1,1.15) U6.3 ; 8.37,7.6 8.9,7.6 TP1.1 ; U1.1 v1(10.02,4.16) ; 7.88,3.21 v1(6.48,3.21)
  Top Layer w0.508: v1(9.02,6.95) 8.37,7.6 CN3.B4A9 ; CN2.1 35.31,13.56 35.75,14 35.75,16.35 C13.2 C14.2
  Top Layer w0.762: R2.2 v1(18.8,1.36)
  vias: v1(3.66,12.9) v1(4.93,19.25) v1(4.93,12.9) v1(6.2,19.25) v1(7.47,19.25) v1(8.74,19.25) v1(8.74,17.98) v1(13.02,18.74) v1(13.02,17.47) v1(14.29,18.74)
GND: length 49.6
  Top Layer w0.254: C1.1 7.87,1.8 v1(7.87,0.86) 11.05,0.86 11.43,1.24 U1.11 11.93,3.01 U1.9 13.97,3.01 R1.1 v1(15.24,3.26) ; C7.1 26.99,15.46 C11.1 27.31,16.67 v1(27.31,17.24) ; U4.23 v1(28.07,12) ; SW2.3 15.88,7.84 v1(16.38,8.35) ; 19.49,3.4 19.49,3.46 v1(18.54,4.41) 17.59,4.41 C6.1 ; C5.1 18.25,15.53 v1(18.79,14.98) 18.89,15.08 19.94,15.08 20.23,14.79 U4.35 20.23,13.21 19.94,12.92 15.95,12.92 SW2.4 ; C16.1 14.41,16.86 v1(15.37,16.86) 15.62,17.11 C15.2 16.45,18.51 v1(17.91,18.51) U5.5 19.11,18.51 C3.1 ; R5.1 29.97,1.11 v1(29.84,1.24) ; v1(16.38,8.35) 17.03,9 U4.44 ; v1(16.38,8.35) 16.38,8.26 17.15,7.5 U4.47 ; v1(31.24,6.83) 32.7,6.83 SW1.3 32.88,6.11 C10.1 32.5,5.38 Q1.2 ; SW1.4 32.88,14.32 ; C4.1 23.97,3.78 23.47,4.27 23.47,4.34 23.24,4.58 23.24,5.48 U4.8 23.24,5.51 v1(23.24,6.95)
  Top Layer w0.508: CN3.B1A12 7.43,6.35 CN3.EP
  vias: v1(7.98,15.44) v1(33.12,11.79) v1(33.12,10.52) v1(36.93,13.06) v1(36.93,11.79) v1(36.93,10.52) v1(36.93,9.25) v1(36.93,7.98) v1(36.93,6.71) v1(38.2,13.06) v1(38.2,11.79) v1(38.2,10.52) v1(38.2,9.25) v1(38.2,7.98) v1(38.2,6.71) v1(38.2,4.17) v1(39.47,11.79) v1(39.47,10.52) v1(39.47,9.25) v1(39.47,7.98) v1(40.74,15.6) v1(40.74,11.79) v1(40.74,10.52) v1(40.74,9.25) v1(40.74,7.98) v1(40.74,4.17) v1(42.01,11.79) v1(42.01,10.52) v1(42.01,9.25) v1(42.01,7.98) v1(43.28,11.79) v1(43.28,10.52) v1(43.28,9.25) v1(43.28,7.98)
BTN_MINUS: length 22.1
  Top Layer w0.254: v1(17.02,16.22) 17.27,16.48 18.43,16.48 19.39,15.51 22.41,15.51 23.14,14.78 23.14,14.08 U4.29 ; v1(16.51,14.32) 13.44,14.32 SW2.2 SW2.1 12.06,6.94 TP9.1
  Inner2 w0.254: v1(17.02,16.22) 17.02,14.83 v1(16.51,14.32)
BTN_PLUS: length 17.9
  Top Layer w0.254: TP8.1 29.12,5.72 SW1.1 SW1.2 29.05,12.92 v1(27.94,12.92) ; U4.30 v1(22.73,10.76)
  Inner2 w0.254: v1(27.94,12.92) 25.78,10.76 v1(22.73,10.76)
CC1: length 15
  Top Layer w0.254: U1.4 9.94,2.09 9.19,2.09 8.77,2.51 6.35,2.51 5.46,3.4 5.46,4.16 4.6,5.03 4.6,9.26 6.58,11.25 CN3.A5
CC2: length 13.3
  Top Layer w0.254: v1(9.02,1.49) 9.03,1.51 U1.5 ; v1(5.84,8.22) 7.4,8.22 CN3.B5
  Inner2 w0.254: v1(9.02,1.49) 6.73,1.49 5.72,2.51 5.72,4.16 4.7,5.17 4.7,7.71 5.21,8.22 v1(5.84,8.22)
D+: length 11.5
  Top Layer w0.254: CN3.B6 7.44,9.24 9.14,9.24 ; 9.14,9.24 9.91,8.48 9.91,5.17 9.14,4.41 9.14,3.14 9.28,3.01 U1.2 ; 9.14,9.24 8.13,10.25 CN3.A6
D-: length 15.3
  Top Layer w0.254: CN3.B7 6.72,10.75 5.72,9.75 ; 5.72,9.75 CN3.A7 ; 5.72,9.75 4.95,8.98 4.95,5.17 5.84,4.28 8.24,4.28 8.79,3.74 8.79,2.99 9.19,2.59 9.94,2.59 U1.3
DUMMY_LOAD_PWM: length 13.1
  Top Layer w0.254: U4.17 27.94,9 28.12,8.82 28.12,5.5 28.5,5.12 30.05,5.12 TP5.1 31.24,5.07 31.24,4.28 32.5,3.03 Q1.1 32.5,1.23 R5.2
FAN_PWM_3V3: length 28.2
  Top Layer w0.254: U4.16 21.44,8.5 v1(21.34,8.6) ; TP6.1 18.86,16.8 U5.4 18.15,17.86 v1(17.91,17.62)
  Inner2 w0.254: v1(21.34,8.6) 21.34,7.07 20.43,6.17 20.21,6.17 14.71,11.67 14.71,17.35 15.87,18.51 17.02,18.51 v1(17.91,17.62)
FAN_PWM_5V: length 37.3
  Top Layer w0.254: 16.96,17.86 16.35,17.25 16.35,17.02 15.49,16.16 v1(15.49,15.97) ; v1(14.73,5.3) 14.73,8.73 16.26,10.25 v1(16.26,11.4)
  Inner2 w0.254: v1(16.26,11.4) 16.26,13.75 15.93,14.08 15.93,14.56 16.26,14.89 16.26,15.21 v1(15.49,15.97) ; CN2.2 30.61,5.3 27.62,5.3 27.17,4.84 26.68,4.84 26.22,5.3 v1(14.73,5.3)
LED_B: length 13.4
  Top Layer w0.254: v1(26.8,6.32) 26.8,6.93 U4.13 ; v1(31.12,7.59) R9.1
  Inner2 w0.254: v1(31.12,7.59) 28.07,7.59 v1(26.8,6.32)
LED_G: length 14.6
  Top Layer w0.254: U4.12 25.3,5.43 v1(26.92,5.43) ; v1(30.35,6.95) 30.53,7.13 30.53,7.83 30.73,8.03 30.73,14.7 30.23,15.21 R6.2
  Inner2 w0.254: v1(30.35,6.95) 28.45,6.95 v1(26.92,5.43)
LED_R: length 14.4
  Top Layer w0.254: U4.11 24.81,5.58 24.81,6.28 25.02,6.49 v1(25.02,6.95) ; v1(29.97,8.35) 29.97,14.19 29.34,14.83 R8.2
  Inner2 w0.254: v1(29.97,8.35) 29.57,7.94 27.92,7.94 26.93,6.95 v1(25.02,6.95)
SWCLK: length 20.4
  Top Layer w0.254: U4.37 19.22,12.5 20.19,11.52 v1(20.96,11.52)
  Inner2 w0.254: 30.86,18.25 31.95,17.16 32.39,17.16 32.94,16.61 32.94,15.83 30.87,13.76 26.37,13.76 24.13,11.52 v1(20.96,11.52)
SWDIO: length 20.5
  Top Layer w0.254: U4.34 20.73,12.44 v1(20.7,12.41)
  Inner2 w0.254: v1(20.7,12.41) 22.48,12.41 24.18,14.11 30.72,14.11 32.59,15.98 32.59,16.47 32.25,16.81 29.77,16.81 CN1.2
~RST: length 1.7
  Top Layer w0.254: C4.2 22.79,5.43 U4.7
$1N1426: length 2
  Top Layer w0.254: U1.8 13.97,2.51 14.22,2.25 R1.2
$2N1442: length 2.4
  Top Layer w0.762: R2.1 22.65,1.36
$2N1481: length 2.8
  Top Layer w0.762: R4.2 28.28,1.24 26.92,1.24 26.8,1.36 R3.1
$2N2065: length 4.7
  Top Layer w0.762: R4.1 28.16,4.08 28.16,3.05 28.7,2.51 30.23,2.51 30.5,2.78 Q1.3
$3N2042: length 13.2
  Top Layer w0.254: R8.1 28.75,16.28 28.7,16.22 v1(28.7,14.7) ; v1(20.7,16.1) 20.7,17.37 21.22,17.89 LED3.1
  Inner2 w0.254: v1(20.7,16.1) 21.34,16.1 22.73,14.7 v1(28.7,14.7)
$3N2244: length 11.1
  Top Layer w0.254: v1(24.31,16.22) 24.31,17.71 24.13,17.89 LED3.2 ; R9.2 31.17,16.22 v1(32,16.22)
  Inner2 w0.254: v1(24.31,16.22) v1(32,16.22)
$3N2246: length 11
  Top Layer w0.254: v1(23.5,15.46) 23.04,15.46 LED3.4 ; v1(27.94,15.46) 27.94,16.73 28.19,16.98 29.72,16.98 30.23,16.48 R6.1
  Inner2 w0.254: v1(27.94,15.46) v1(23.5,15.46)

## Copper pours and planes (outline as drawn; the poured copper is in the pictures)
+12V on Top Layer: 2.29,15.21 3.3,16.22 1.91,17.62 1.91,20.03 2.29,20.41 2.79,20.41 2.92,20.54 15.11,20.54 15.11,18 14.86,17.75 13.97,17.75 13.46,17.24 13.46,16.22 13.34,16.1 9.4,16.1 8.25,14.95 8.25,11.65 8.13,11.52 3.56,11.52 2.29,12.79
+12V on Inner1: -1.4,21.18 46.1,21.18 46.1,-1.43 -1.4,-1.43
GND on Top Layer: 31.12,21.05 30.48,20.41 30.48,-1.3 31.88,-2.7 46.61,-2.7 48.64,-0.67 48.64,20.16 47.75,21.05
GND on Top Layer: 6.16,17.11 5.84,16.79 5.84,15.46 5.33,14.95 5.33,14.06 6.48,12.92 6.48,12.79 8.89,12.79 10.03,13.94 10.03,15.94 9.75,16.22 9.53,16.22 8.64,17.11
GND on Top Layer: 34.79,0 42.51,0 34.16,8.35 34.16,5.68 34.29,5.56 34.29,0.5
GND on Bottom Layer: -0.76,20.54 45.72,20.54 45.72,-0.8 -0.76,-0.8

## Text on the board
Bottom Silkscreen Layer: (c) 2025-09 randers / usbc-fursuit-fan / Board v1.0 | +12V | PWM | GND | +3V3 | SWDIO | SWCLK | FAN
Top Silkscreen Layer: +12V | PWM | GND | FAN
